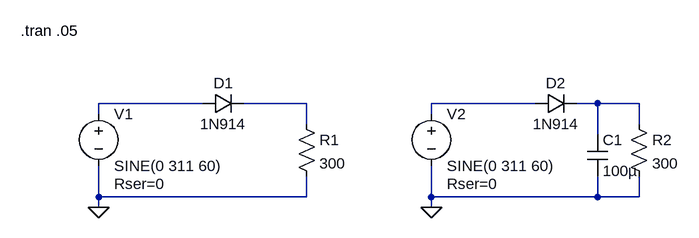
[diagram p0: schematic Diodo - RetificadorMeiaOnda.asc]
Diodo - RetificadorMeiaOnda.asc, the LTspice schematic file:
Version 4
SHEET 1 880 680
WIRE -224 0 -384 0
WIRE -64 0 -160 0
WIRE 288 0 128 0
WIRE 384 0 352 0
WIRE 448 0 384 0
WIRE -384 16 -384 0
WIRE 128 16 128 0
WIRE -64 32 -64 0
WIRE 448 32 448 0
WIRE 384 48 384 0
WIRE -384 144 -384 96
WIRE -64 144 -64 112
WIRE -64 144 -384 144
WIRE 128 144 128 96
WIRE 384 144 384 112
WIRE 384 144 128 144
WIRE 448 144 448 112
WIRE 448 144 384 144
WIRE -384 160 -384 144
WIRE 128 160 128 144
FLAG -384 160 0
FLAG 128 160 0
SYMBOL res -80 16 R0
SYMATTR InstName R1
SYMATTR Value 300
SYMBOL diode -224 16 R270
WINDOW 0 32 32 VTop 2
WINDOW 3 0 32 VBottom 2
SYMATTR InstName D1
SYMATTR Value 1N914
SYMBOL voltage -384 0 R0
WINDOW 123 0 0 Left 2
WINDOW 39 24 124 Left 2
SYMATTR SpiceLine Rser=0
SYMATTR InstName V1
SYMATTR Value SINE(0 311 60)
SYMBOL res 432 16 R0
SYMATTR InstName R2
SYMATTR Value 300
SYMBOL diode 288 16 R270
WINDOW 0 32 32 VTop 2
WINDOW 3 0 32 VBottom 2
SYMATTR InstName D2
SYMATTR Value 1N914
SYMBOL voltage 128 0 R0
WINDOW 123 0 0 Left 2
WINDOW 39 24 124 Left 2
SYMATTR SpiceLine Rser=0
SYMATTR InstName V2
SYMATTR Value SINE(0 311 60)
SYMBOL cap 368 48 R0
SYMATTR InstName C1
SYMATTR Value 100µ
TEXT -504 -112 Left 2 !.tran .05

The netlist it stands for:
* Diodo - RetificadorMeiaOnda.asc
R1 N002 0 300
D1 N001 N002 1N914
V1 N001 0 SINE(0 311 60) Rser=0
R2 N004 0 300
D2 N003 N004 1N914
V2 N003 0 SINE(0 311 60) Rser=0
C1 N004 0 100µ
.model D D
.lib standard.dio
.tran .05
.backanno
.end